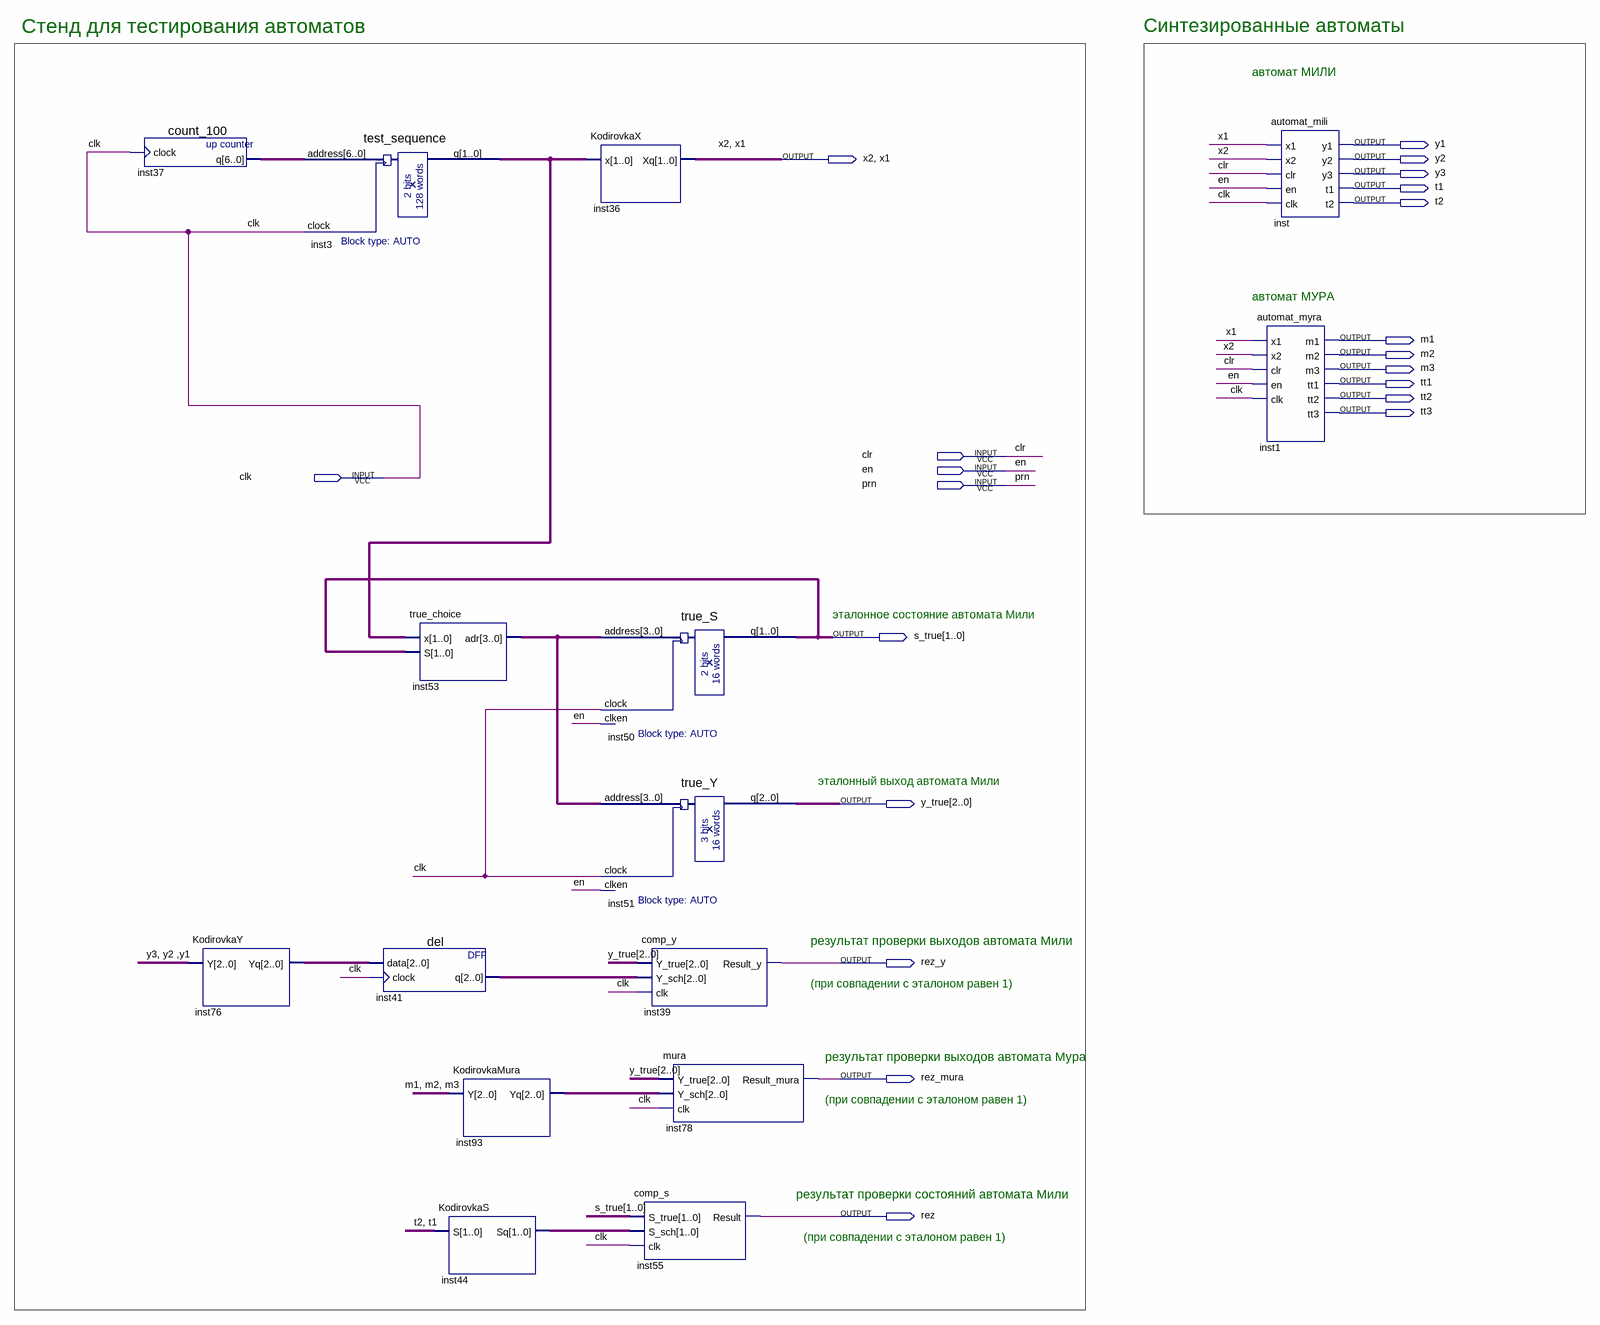
[diagram p0: schematic sheet]
// Quartus schematic begin.bdf as structural Verilog: 15 symbols, 21 pins
module \begin  (
  input  clr,
  input  en,
  input  clk,
  input  prn,
  output y1,
  output x2,
  output x1,
  output y2,
  output y3,
  output t1,
  output t2,
  output m1,
  output m2,
  output m3,
  output tt1,
  output tt2,
  output tt3,
  output [1:0] s_true,
  output [2:0] y_true,
  output rez_y,
  output rez_mura,
  output rez
);

  wire [1:0] inst3_q, inst44_sq;
  wire [2:0] inst41_q, inst76_yq, inst93_yq;
  wire [3:0] inst53_adr;
  wire [6:0] inst37_q;

  count_100 inst37 (.clock(clk), .q(inst37_q));
  KodirovkaY inst76 (.Y({y3, y2, y1}), .Yq(inst76_yq));
  test_sequence inst3 (.address(inst37_q), .clock(clk), .q(inst3_q));
  true_choice inst53 (.x(inst3_q), .S(s_true), .adr(inst53_adr));
  del inst41 (.data(inst76_yq), .clock(clk), .q(inst41_q));
  KodirovkaMura inst93 (.Y({m1, m2, m3}), .Yq(inst93_yq));
  KodirovkaS inst44 (.S({t2, t1}), .Sq(inst44_sq));
  KodirovkaX inst36 (.x(inst3_q), .Xq({x2, x1}));
  true_S inst50 (.address(inst53_adr), .clock(clk), .clken(en), .q(s_true));
  true_Y inst51 (.address(inst53_adr), .clock(clk), .clken(en), .q(y_true));
  comp_y inst39 (.Y_true(y_true), .Y_sch(inst41_q), .clk(clk), .Result_y(rez_y));
  comp_s inst55 (.S_true(s_true), .S_sch(inst44_sq), .clk(clk), .Result(rez));
  mura inst78 (.Y_true(y_true), .Y_sch(inst93_yq), .clk(clk), .Result_mura(rez_mura));
  automat_mili inst (.x1(x1), .x2(x2), .clr(clr), .en(en), .clk(clk), .y1(y1), .y2(y2), .y3(y3), .t1(t1), .t2(t2));
  automat_myra inst1 (
    .x1(x1), .x2(x2), .clr(clr), .en(en), .clk(clk), .m1(m1), .m2(m2), .m3(m3), .tt1(tt1), .tt2(tt2),
    .tt3(tt3));

  // Notes on the sheet:
  //   Стенд для тестирования автоматов
  //   Синтезированные автоматы
  //   автомат МИЛИ
  //   автомат МУРА
  //   эталонное состояние автомата Мили
  //   эталонный выход автомата Мили
  //   результат проверки выходов автомата Мили
  //   (при совпадении с эталоном равен 1)
  //   результат проверки выходов автомата Мура
  //   (при совпадении с эталоном равен 1)
  //   результат проверки состояний автомата Мили
  //   (при совпадении с эталоном равен 1)
endmodule
